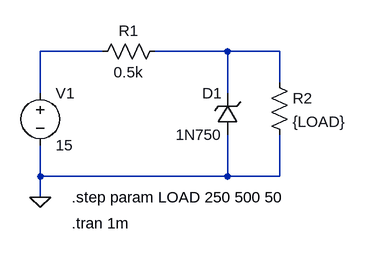
[diagram p0: schematic STEP param Regulador Zener.asc]
STEP param Regulador Zener.asc, the LTspice schematic file:
Version 4
SHEET 1 880 680
WIRE 128 32 32 32
WIRE 320 32 208 32
WIRE 400 32 320 32
WIRE 400 80 400 32
WIRE 32 96 32 32
WIRE 320 96 320 32
WIRE 32 224 32 176
WIRE 320 224 320 160
WIRE 320 224 32 224
WIRE 400 224 400 160
WIRE 400 224 320 224
WIRE 32 256 32 224
FLAG 32 256 0
SYMBOL voltage 32 80 R0
SYMATTR InstName V1
SYMATTR Value 15
SYMBOL res 224 16 R90
WINDOW 0 0 56 VBottom 2
WINDOW 3 32 56 VTop 2
SYMATTR InstName R1
SYMATTR Value 0.5k
SYMBOL res 384 64 R0
SYMATTR InstName R2
SYMATTR Value {LOAD}
SYMBOL zener 336 160 R180
WINDOW 0 24 64 Left 2
WINDOW 3 24 0 Left 2
SYMATTR InstName D1
SYMATTR Value 1N750
SYMATTR Description Diode
SYMATTR Type diode
TEXT 80 256 Left 2 !.step param LOAD 250 500 50
TEXT 80 296 Left 2 !.tran 1m

The netlist it stands for:
* STEP param Regulador Zener.asc
V1 N001 0 15
R1 N002 N001 0.5k
R2 N002 0 {LOAD}
D1 0 N002 1N750
.model D D
.lib standard.dio
.step param LOAD 250 500 50
.tran 1m
.backanno
.end